# EasyEDA schematic Schematics.json
TITLE: CO2-Sensor; REV: 1.0; Date: 2021-05-13; Sheet: 1/1; Drawn By: Julian Partanen; Company: Gymnasium St. Mauritz
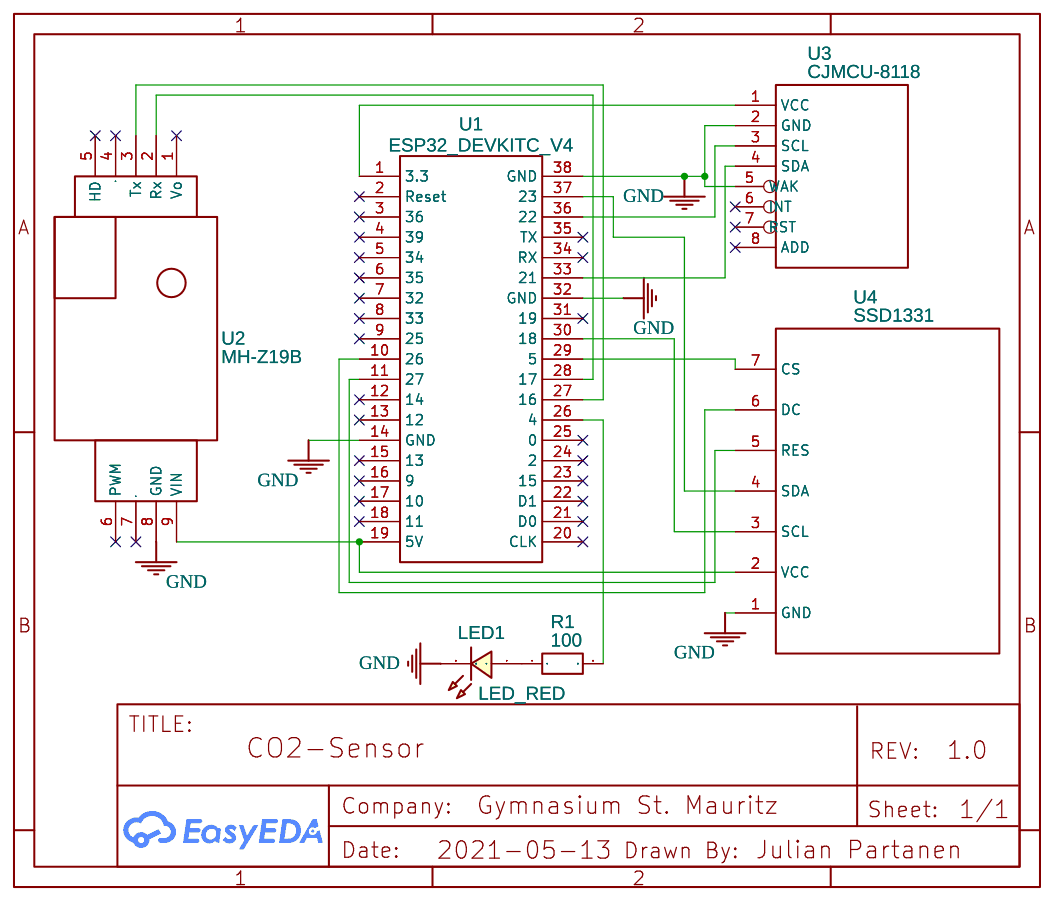
[diagram p0: schematic sheet]

## Parts
LED1  LED_RED  [LED0603_RED]
R1  100  [R0603]
U1  ESP32_DEVKITC_V4  [ESP32_DEVKITC_V4]
U2  MH-Z19B
U3  CJMCU-8118  [CJMCU-8118]
U4  SSD1331  [SSD1331]

## Library data of the parts
LED1 = LED-0603_R: Manufacturer: EVERLIGHT(台湾亿光); Manufacturer Part: 19-217/R6C-AL1M2VY/3T; Supplier Part: C72044; Supplier: LCSC; Contributor: LCEDA_01
R1 = R_0603_EU: Contributor: LCEDA_Lib
U1 = ESP32_DEVKITC_V4 COPY: Contributor: Jeff Jacobs
U2 = MH-Z19B: Contributor: sasha rats
U3 = CJMCU-8118: Contributor: LucAce
U4 = SSD1331: Contributor: Manuel Müller

## Nets
GND: LED1.2 U1.14(GND) U1.32(GND) U1.38(GND) U2.8(GND) U3.2(GND) U3.5(WAK) U4.1(GND)
Net-(LED1-1): LED1.1 R1.1
Net-(R1-2): R1.2 U1.26(4)
Net-(U1-1): U1.1(3.3) U3.1(VCC)
Net-(U1-10): U1.10(26) U4.6(DC)
Net-(U1-11): U1.11(27) U4.5(RES)
Net-(U1-19): U1.19(5V) U2.9(VIN) U4.2(VCC)
Net-(U1-27): U1.27(16) U2.3(Tx)
Net-(U1-28): U1.28(17) U2.2(Rx)
Net-(U1-29): U1.29(5) U4.7(CS)
Net-(U1-30): U1.30(18) U4.3(SCL)
Net-(U1-33): U1.33(21) U3.4(SDA)
Net-(U1-36): U1.36(22) U3.3(SCL)
Net-(U1-37): U1.37(23) U4.4(SDA)

Not connected (* = marked no-connect by the designer): U1 2(Reset)* 3(36)* 4(39)* 5(34)* 6(35)* 7(32)* 8(33)* 9(25)* 12(14)* 13(12)* 15(13)* 16(9)* 17(10)* 18(11)* 20(CLK)* 21(D0)* 22(D1)* 23(15)* 24(2)* 25(0)* 31(19)* 34(RX)* 35(TX)*; U2 1(Vo)* 4* 5(HD)* 6(PWM)* 7*; U3 6(INT)* 7(RST)* 8(ADD)*
